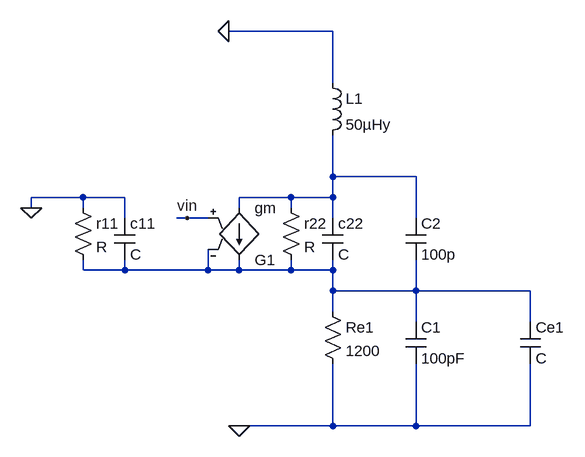
[diagram p0: schematic Collpits_b.asc]
Collpits_b.asc, the LTspice schematic file:
Version 4
SHEET 1 880 680
WIRE 64 -272 -96 -272
WIRE 64 -192 64 -272
WIRE 64 -48 64 -112
WIRE 192 -48 64 -48
WIRE -320 -16 -400 -16
WIRE -256 -16 -320 -16
WIRE 0 -16 -80 -16
WIRE 64 -16 64 -48
WIRE 64 -16 0 -16
WIRE -400 0 -400 -16
WIRE -320 0 -320 -16
WIRE -80 0 -80 -16
WIRE 0 0 0 -16
WIRE -256 16 -256 -16
WIRE -160 16 -176 16
WIRE -128 16 -160 16
WIRE 64 16 64 -16
WIRE 192 16 192 -48
WIRE -320 96 -320 80
WIRE -256 96 -256 80
WIRE -256 96 -320 96
WIRE -128 96 -128 64
WIRE -128 96 -256 96
WIRE -80 96 -80 80
WIRE -80 96 -128 96
WIRE 0 96 0 80
WIRE 0 96 -80 96
WIRE 64 96 64 80
WIRE 64 96 0 96
WIRE 64 128 64 96
WIRE 192 128 192 80
WIRE 192 128 64 128
WIRE 368 128 192 128
WIRE 64 160 64 128
WIRE 192 176 192 128
WIRE 368 176 368 128
WIRE -80 336 -96 336
WIRE 64 336 64 240
WIRE 64 336 -80 336
WIRE 192 336 192 240
WIRE 192 336 64 336
WIRE 368 336 368 240
WIRE 368 336 192 336
FLAG -96 -272 0
FLAG -80 336 0
FLAG -400 0 0
FLAG -160 16 vin
SYMBOL ind 48 -208 R0
SYMATTR InstName L1
SYMATTR Value 50µHy
SYMBOL res 48 144 R0
SYMATTR InstName Re1
SYMATTR Value 1200
SYMBOL cap 176 176 R0
SYMATTR InstName C1
SYMATTR Value 100pF
SYMBOL cap 176 16 R0
SYMATTR InstName C2
SYMATTR Value 100p
SYMBOL cap 352 176 R0
SYMATTR InstName Ce1
SYMBOL cap 48 16 R0
SYMATTR InstName c22
SYMBOL res -16 -16 R0
SYMATTR InstName r22
SYMBOL g2 -80 96 M180
SYMATTR InstName G1
SYMATTR Value gm
SYMBOL cap -272 16 R0
SYMATTR InstName c11
SYMBOL res -336 -16 R0
SYMATTR InstName r11

The netlist it stands for:
* Collpits_b.asc
L1 0 N001 50µHy
Re1 N002 0 1200
C1 N002 0 100pF
C2 N001 N002 100p
Ce1 N002 0 C
c22 N001 N002 C
r22 N001 N002 R
G1 N001 N002 vin N002 gm
c11 0 N002 C
r11 0 N002 R
.backanno
.end